# Altium project USB_Audio_DAC_REV1.PrjPCB
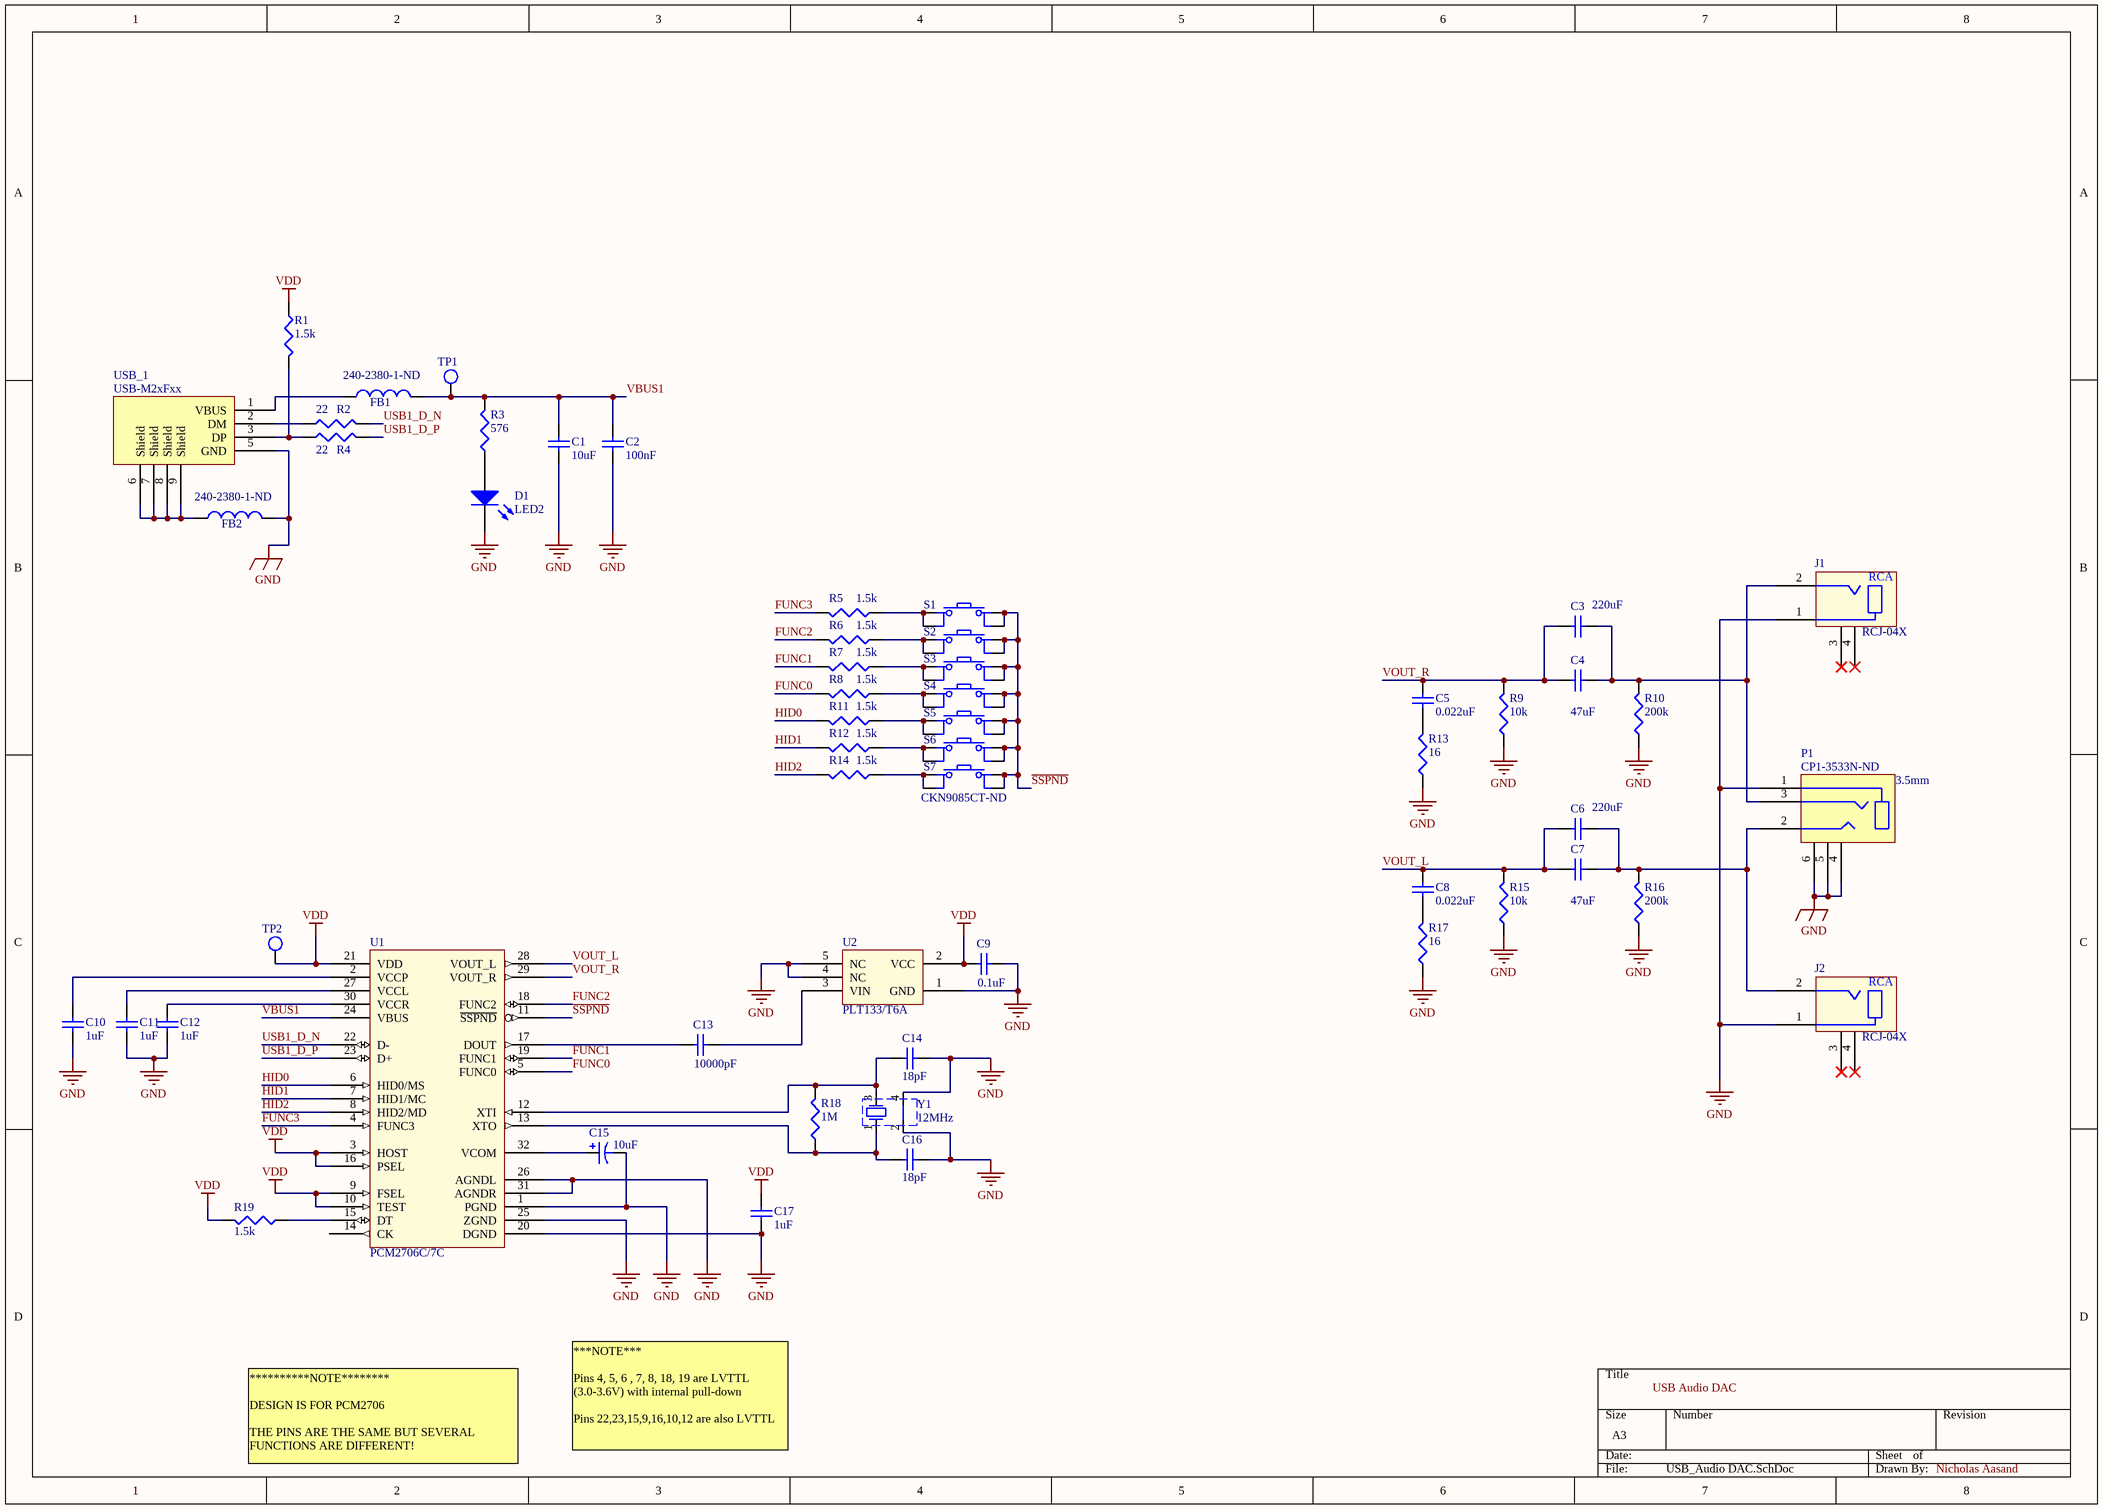
[diagram p0: USB_Audio DAC.SchDoc]
1 sheet, 55 parts. Net scope: global (net labels, ports and power ports of the same name join across sheets).
Board file: USB_Audio_DAC_REV1.PcbDoc

## Sheet USB_Audio DAC.SchDoc
size A3

### Parts
C1  value 10uF  [C0805]  (hidden comment: 0805)
C2  value 100nF  [C0805]  (hidden comment: 0805)
C3  value 220uF  [CAPPR5-10x12.5]  (hidden comment: Cap)
C4  value 47uF  [CAPPR2-5x11]  (hidden comment: Cap)
C5  value 0.022uF  [C0805]  (hidden comment: 0805)
C6  value 220uF  [CAPPR5-10x12.5]  (hidden comment: Cap)
C7  value 47uF  [CAPPR2-5x11]  (hidden comment: Cap)
C8  value 0.022uF  [C0805]  (hidden comment: 0805)
C9  value 0.1uF  [C0805]  (hidden comment: Cap Semi)
C10  value 1uF  [C0805]  (hidden comment: 0805)
C11  value 1uF  [C0805]  (hidden comment: 0805)
C12  value 1uF  [C0805]  (hidden comment: 0805)
C13  value 10000pF  [C0805]  (hidden comment: Cap Semi)
C14  value 18pF  [CAPC1608L]  (hidden comment: 0805)
C15  value 10uF  [Cap_ALUM_SMD]  (hidden comment: Cap Pol3)
C16  value 18pF  [CAPC1608L]  (hidden comment: 0805)
C17  value 1uF  [C0805]  (hidden comment: 0805)
D1  LED2  [2.00mm L x 1.25mm W]
FB1  Digikey: 240-2380-1-ND  [INDC1608L]  (hidden comment: 0603)
FB2  Digikey: 240-2380-1-ND  [INDC1608L]  (hidden comment: 0603)
J1  RCJ-04X  [RCJ-04X]
J2  RCJ-04X  [RCJ-04X]
P1  Digikey: CP1-3533N-ND  [SJ1-3533NS]  (hidden comment: SJ1-3533NS)
R1  value 1.5k  [RESC2012L]  (hidden comment: 0805)
R2  value 22  [6-0805_N]  (hidden comment: Res3)
R3  value 576  [6-0805_N]  (hidden comment: Res3)
R4  value 22  [6-0805_N]  (hidden comment: Res3)
R5  value 1.5k  [RESC2012L]  (hidden comment: 0805)
R6  value 1.5k  [RESC2012L]  (hidden comment: 0805)
R7  value 1.5k  [RESC2012L]  (hidden comment: 0805)
R8  value 1.5k  [RESC2012L]  (hidden comment: 0805)
R9  value 10k  [RESC2012L]  (hidden comment: 0805)
R10  value 200k  [RESC2012L]  (hidden comment: 0805)
R11  value 1.5k  [RESC2012L]  (hidden comment: 0805)
R12  value 1.5k  [RESC2012L]  (hidden comment: 0805)
R13  value 16  [6-0805_N]  (hidden comment: Res3)
R14  value 1.5k  [RESC2012L]  (hidden comment: 0805)
R15  value 10k  [RESC2012L]  (hidden comment: 0805)
R16  value 200k  [RESC2012L]  (hidden comment: 0805)
R17  value 16  [6-0805_N]  (hidden comment: Res3)
R18  value 1M  [6-0805_N]  (hidden comment: Res3)
R19  value 1.5k  [RESC2012L]  (hidden comment: 0805)
S1  SW  [C&K_PTS645_SMD]  (value not drawn)
S2  SW  [C&K_PTS645_SMD]  (value not drawn)
S3  SW  [C&K_PTS645_SMD]  (value not drawn)
S4  SW  [C&K_PTS645_SMD]  (value not drawn)
S5  SW  [C&K_PTS645_SMD]  (value not drawn)
S6  SW  [C&K_PTS645_SMD]  (value not drawn)
S7  Digikey: CKN9085CT-ND  [C&K_PTS645_SMD]  (hidden comment: SW)
TP1  Test point  [Test_Pad]  (value not drawn)
TP2  Test point  [Test_Pad]  (value not drawn)
U1  PCM2706C/7C  [TQFP80P970X970X120-32N]
U2  PLT133/T6A  [PLT133/T10W]
USB_1  USB-M2xFxx  [USB-M2xFxx]
Y1  12MHz  [TXC-7M]

### Nets
GND: C1.2 C2.2 C9.2 C10.2 C11.2 C12.2 C14.1 C15.2 C16.1 C17.2 D1.2(K) FB2.2 J1.1(GND) J2.1(GND) P1.1(Sleeve) P1.4(Shield) P1.5(Shield) P1.6(Shield) R9.1 R10.1 R13.1 R15.1 R16.1 R17.1 U1.1(PGND) U1.20(DGND) U1.25(ZGND) U1.26(AGNDL) U1.31(AGNDR) U2.1(GND) U2.4(NC) U2.5(NC) USB_1.5(GND) Y1.2 Y1.4
VDD: C9.1 C17.1 R1.1 R19.2 TP2.1 U1.3(HOST) U1.9(FSEL) U1.10(TEST) U1.16(PSEL) U1.21(VDD) U2.2(VCC)
FUNC0: R8.2 U1.5(FUNC0)
FUNC1: R7.2 U1.19(FUNC1)
FUNC2: R6.2 U1.18(FUNC2)
FUNC3: R5.2 U1.4(FUNC3)
HID0: R11.2 U1.6(HID0/MS)
HID1: R12.2 U1.7(HID1/MC)
HID2: R14.2 U1.8(HID2/MD)
~{SSPND}: S1.2 S1.4 S2.2 S2.4 S3.2 S3.4 S4.2 S4.4 S5.2 S5.4 S6.2 S6.4 S7.2 S7.4 U1.11(~{SSPND})
USB1_D_N: R2.2 U1.22(D-)
USB1_D_P: R4.2 U1.23(D+)
VBUS1: C1.1 C2.1 FB1.2 R3.2 TP1.1 U1.24(VBUS)
VOUT_L: C6.1 C7.1 C8.1 R15.2 U1.28(VOUT_L)
VOUT_R: C3.1 C4.1 C5.1 R9.2 U1.29(VOUT_R)
NetC3_2: C3.2 C4.2 J1.2(Vin) P1.3(Ring) R10.2
NetC5_2: C5.2 R13.2
NetC6_2: C6.2 C7.2 J2.2(Vin) P1.2(Tip) R16.2
NetC8_2: C8.2 R17.2
NetC10_1: C10.1 U1.2(VCCP)
NetC11_1: C11.1 U1.27(VCCL)
NetC12_1: C12.1 U1.30(VCCR)
NetC13_1: C13.1 U1.17(DOUT)
NetC13_2: C13.2 U2.3(VIN)
NetC14_2: C14.2 R18.2 U1.12(XTI) Y1.3
NetC15_1: C15.1 U1.32(VCOM)
NetC16_2: C16.2 R18.1 U1.13(XTO) Y1.1
NetD1_1: D1.1(A) R3.1
NetFB1_1: FB1.1 USB_1.1(VBUS)
NetFB2_1: FB2.1 USB_1.6(Shield) USB_1.7(Shield) USB_1.8(Shield) USB_1.9(Shield)
NetR1_2: R1.2 R4.1 USB_1.3(DP)
NetR2_1: R2.1 USB_1.2(DM)
NetR5_1: R5.1 S1.1 S1.3
NetR6_1: R6.1 S2.1 S2.3
NetR7_1: R7.1 S3.1 S3.3
NetR8_1: R8.1 S4.1 S4.3
NetR11_1: R11.1 S5.1 S5.3
NetR12_1: R12.1 S6.1 S6.3
NetR14_1: R14.1 S7.1 S7.3
NetR19_1: R19.1 U1.15(DT)

Not connected (* = marked no-connect by the designer): J1 3(NC)* 4(NC)*; J2 3(NC)* 4(NC)*; U1 14(CK); USB_1 4(NC)

### Notes on the sheet
- USB Audio DAC
- **********NOTE********
  DESIGN IS FOR PCM2706
  THE PINS ARE THE SAME BUT SEVERAL FUNCTIONS ARE DIFFERENT!
- ***NOTE***
  Pins 4, 5, 6 , 7, 8, 18, 19 are LVTTL
  (3.0-3.6V) with internal pull-down
  Pins 22,23,15,9,16,10,12 are also LVTTL
- Nicholas Aasand
- (in symbol RCJ-04X) RCA
- (in symbol SJ1-3533NS) 3.5mm

### Library data of the parts
C1 C2 C5 C8-C14 C16 C17 = Cap Semi: Capacitor (Semiconductor SIM Model); Published: 8-Jun-2000; LatestRevisionDate: 29-May-2009; LatestRevisionNote: IPC-7351 Footprint Added.; Publisher: Altium Limited; PackageDescription: Chip Capacitor
  C1 C2: PackageReference: C1206; Digikey: 311-1361-1-ND
  C5 C8: PackageReference: C1206; Digikey: 1276-1081-1-ND
  C9: PackageReference: C0805; Digikey: 399-1170-1-ND
  C10-C12 C17: PackageReference: C1206; Digikey: 311-1365-1-ND
  C13: PackageReference: C0805; Digikey: 399-1158-1-ND
  C14 C16: PackageReference: C1206; Digikey: 1276-1089-1-ND
C3 C4 C6 C7 = Cap: Capacitor; Published: 8-Jun-2000; LatestRevisionDate: 17-Jul-2002; LatestRevisionNote: Re-released for DXP Platform.; PackageReference: RAD-0.3; Publisher: Altium Limited; PackageDescription: Radial Cap, Thru-Hole; 2 Leads; 0.3 in Pin Spacing
  C3 C6: Digikey: 604-1136-ND
  C4 C7: Digikey: 604-1139-ND
C15 = Cap Pol3: Polarized Capacitor (Surface Mount); Published: 8-Jun-2000; LatestRevisionDate: 29-May-2009; LatestRevisionNote: IPC-7351 Footprint Added.; PackageReference: C0805; Publisher: Altium Limited; PackageDescription: Chip Capacitor; Digikey: 399-6664-1-ND
D1 = LED2: Typical RED, GREEN, YELLOW, AMBER GaAs LED; Published: 8-Jun-2000; LatestRevisionDate: 17-Jul-2002; LatestRevisionNote: Re-released for DXP Platform.; PackageVersion: Feb-2002; PackageReference: 3.2X1.6X1.1; Publisher: Altium Limited; PackageDescription: SM LED; 2 Flat Leads; Digikey: 754-1130-1-ND
FB1 FB2 = Inductor: Code_IEC: 1005; Value: 600@100MHz; Published: 8-Jun-2000; LatestRevisionDate: 29-May-2009; LatestRevisionNote: IPC-7351 Footprint Added.; PackageReference: 0402-A; Publisher: Altium Limited; PackageDescription: Chip Inductor; Code_JEITA: 0402
J1 J2 = RCJ-04X: RCJ-04X series RCA connector
P1 = SJ1-3533NS: CUI 3.5mm Audio Jack Shielded
R1-R19 = Res3: Resistor
  R1 R5-R8 R11 R12 R14 R19: Digikey: 311-1.5KARCT-ND
  R2 R4: Published: 8-Jun-2000; LatestRevisionDate: 29-May-2009; LatestRevisionNote: IPC-7351 Footprint Added.; PackageReference: J1-0603; Publisher: Altium Limited; PackageDescription: Chip Resistor; Digikey: 311-22.0CRCT-ND
  R3: Published: 8-Jun-2000; LatestRevisionDate: 29-May-2009; LatestRevisionNote: IPC-7351 Footprint Added.; PackageReference: J1-0603; Publisher: Altium Limited; PackageDescription: Chip Resistor; Digikey: 311-576CRCT-ND
  R9 R15: Digikey: RMCF0805FT10K0CT-ND
  R10 R16: Digikey: 311-200KCRCT-ND
  R13 R17: Published: 8-Jun-2000; LatestRevisionDate: 29-May-2009; LatestRevisionNote: IPC-7351 Footprint Added.; PackageReference: J1-0603; Publisher: Altium Limited; PackageDescription: Chip Resistor; Digikey: 311-16.0CRCT-ND
  R18: Published: 8-Jun-2000; LatestRevisionDate: 29-May-2009; LatestRevisionNote: IPC-7351 Footprint Added.; PackageReference: J1-0603; Publisher: Altium Limited; PackageDescription: Chip Resistor; Digikey: 311-1.00MCRCT-ND
S1-S7 = SPST-4: SPST Tactile switch - generic
  S1-S6: Digikey: CKN9085CT-ND
TP1 TP2 = Test_Pad: Test point pad
U1 = PCM2707: Stereo Audio DAC with USB Interface, Single-Ended Headphone Out, S/PDIF Output
U2 = PLT133/T6A: TRANSMITTER FBR OPT IR PHOTOLINK 660nm; Digikey: 1080-1434-ND
USB_1 = USB-M2xFxx: USB Mini-B for USB-M2xFxx; Digikey: ED2992CT-ND
Y1 = XTAL-4: Crystal Oscillator - 4 Pin; Digikey: 887-1121-1-ND